# Altium schematic sheet RF_Driver.SchDoc: =MainTitle
size 420 x 297 mm; SheetNumber: 4; SheetTotal: 9; EDA_Number: ARTIQ; Projet: ARTIQ/SINARA; ModifiedBy: -; CreateDate: XX/XX/XXXX; CheckedDate: -; Title2: Driver Amplifier; DivGrp: ISE; Designer: shanasz
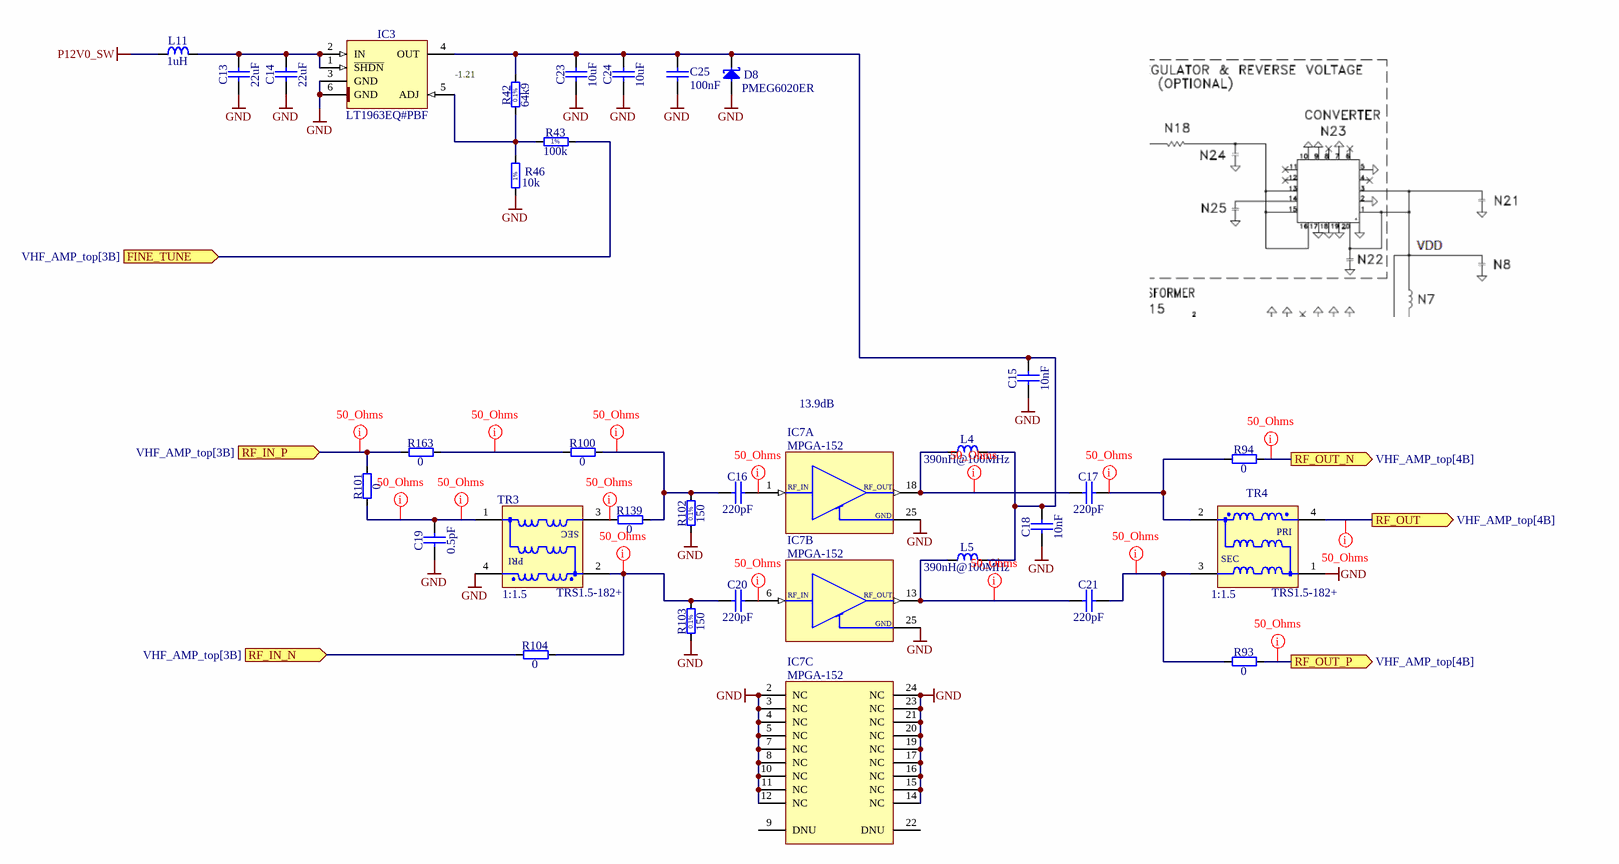
[diagram p0: RF_Driver.SchDoc]

## Parts
C13  22uF  [CAPC3225X140N]
C14  22uF  [CAPC3225X140N]
C15  10nF  [CAPC1005X55N]
C16  220pF  [CAPC1005X55N]
C17  220pF  [CAPC1005X55N]
C18  10nF  [CAPC1005X55N]
C19  0.5pF  [CAPC1005X50N]
C20  220pF  [CAPC1005X55N]
C21  220pF  [CAPC1005X55N]
C23  10uF  [CAPC3225X270N]
C24  10uF  [CAPC3225X270N]
C25  100nF  [CAPC1005X55N]
D8  PMEG6020ER  [SODFL3517X110N]
IC3  LT1963EQ#PBF  [TO170P1394X457-6N-R900X1060]
IC7  MPGA-152  [QFN50P400X400X100-25N-S265]  (parts A,B,C of 3)
L4  390nH@100MHz  [IND_COILCRAFT_0805HP]
L5  390nH@100MHz  [IND_COILCRAFT_0805HP]
L11  1uH  [INDC2620X100N]
R42  64k9  [RESC1608X55N]
R43  100k  [RESC1608X55N]
R46  10k  [RESC1005X40N]
R93  0  [RESC2012X60N]
R94  0  [RESC2012X60N]
R100  0  [RESC2012X60N]
R101  0  [RESC2012X60N]
R102  150  [RESC1608X55N]
R103  150  [RESC1608X55N]
R104  0  [RESC2012X60N]
R139  0  [RESC2012X60N]
R163  0  [RESC2012X60N]
TR3  1:1.5  Manufacturer Part Number: TRS1.5-182+  [XFMR_MINI-CIRCUITS_TT1618]
TR4  1:1.5  Manufacturer Part Number: TRS1.5-182+  [XFMR_MINI-CIRCUITS_TT1618]

## Ports
FINE_TUNE (in, see VHF_AMP_top[3B]), RF_IN_N (in, see VHF_AMP_top[3B]), RF_IN_P (in, see VHF_AMP_top[3B]), RF_OUT (out, see VHF_AMP_top[4B]), RF_OUT_N (out, see VHF_AMP_top[4B]), RF_OUT_P (out, see VHF_AMP_top[4B])

## Nets
GND: C13.1 C14.1 C15.1 C18.1 C19.1 C23.1 C24.1 C25.2 D8.2(A) IC3.3(GND) IC3.6(GND) IC7.2(NC) IC7.3(NC) IC7.4(NC) IC7.5(NC) IC7.7(NC) IC7.8(NC) IC7.10(NC) IC7.11(NC) IC7.12(NC) IC7.14(NC) IC7.15(NC) IC7.16(NC) IC7.17(NC) IC7.19(NC) IC7.20(NC) IC7.21(NC) IC7.23(NC) IC7.24(NC) IC7.25(GND) R46.1 R102.1 R103.1 TR3.4(P1) TR4.1(P1)
P12V0_SW: L11.1
FINE_TUNE: R43.2 ; port FINE_TUNE
RF_IN_N: R104.1 ; port RF_IN_N
RF_IN_P: R101.2 R163.1 ; port RF_IN_P
RF_OUT: TR4.4(P1) ; port RF_OUT
RF_OUT_N: R94.2 ; port RF_OUT_N
RF_OUT_P: R93.2 ; port RF_OUT_P
NetC13_2: C13.2 C14.2 IC3.1(~{SHDN}) IC3.2(IN) L11.2
NetC15_2: C15.2 C18.2 C23.2 C24.2 C25.1 D8.1(C) IC3.4(OUT) L4.2 L5.2 R42.2
NetC16_1: C16.1 R100.2 R102.2 R139.2
NetC16_2: C16.2 IC7.1(RF-IN,_A1)
NetC17_1: C17.1 IC7.18(RF-OUT_and_DC-IN,_A1) L4.1
NetC17_2: C17.2 R94.1 TR4.2(S1)
NetC19_2: C19.2 R101.1 TR3.1(P1)
NetC20_1: C20.1 R103.2 R104.2 TR3.2(S1)
NetC20_2: C20.2 IC7.6(RF_IN,_A2)
NetC21_1: C21.1 IC7.13(RF-OUT_and_DC-IN,_A2) L5.1
NetC21_2: C21.2 R93.1 TR4.3(S1)
NetIC3_5: IC3.5(ADJ) R42.1 R43.1 R46.2
NetR100_1: R100.1 R163.2
NetR139_1: R139.1 TR3.3(S1)

Not connected (* = marked no-connect by the designer): IC7 9(DNU) 22(DNU)

## Layout directives
net class 50_Ohms: NetC16_1, NetC16_2, NetC17_1, NetC17_2, NetC19_2, NetC20_1, NetC20_2, NetC21_1, NetC21_2, NetR100_1, NetR139_1, RF_IN_P, RF_OUT, RF_OUT_N, RF_OUT_P

## Notes on the sheet
- -1.21
- 13.9dB
- Project/Equipment
- Document
- Designer
- Drawn by
- Check.by
- Copyright WUT 2017
  This documentation describes Open Hardware and is licensed under the CERN OHL v.1.1. You may redistribute and modify this documentation under the terms of the CERN OHL v.1.1. (http://ohwr.org/CERNOHL). This documentation is distributed WITHOUT ANY EXPRESS OR IMPLIED WARRANTY, INCLUDING OF MERCHANTABILITY, SATISFACTORY QUALITY AND FITNESS FOR A PARTICULAR PURPOSE. Please see the CERN OHL v.1.1 for applicable conditions.
- File
- Last Mod.
- Print Date
- Sheet
- Size
- A3
- of
- Rev
- (in symbol MPGA-152, part A) RF_IN; RF_OUT
- (in symbol MPGA-152, part B) RF_IN; RF_OUT
- (in symbol R0402_10K_1%_0.0625W_100PPM) 1%
- (in symbol R0603_64K9_0.1%_0.063W_10PPM) 0.1%
- (in symbol R0603_100K_1%_0.1W_100PPM) 1%
- (in symbol R0603_150R_0.1%_0.063W_10PPM) 0.1%
- (in symbol XFMR_MINI-CIRCUITS_TRS1.5-182+) SEC; PRI

## Library data of the parts
C13 C14 = CC1210_22UF_25V_20%_X7R: Non-polarised capacitor; Part Description: SMD Multilayer Chip Ceramic Capacitor; Manufacturer: GENERIC; Manufacturer1 Part Number: C1210C226M3RACTU; Voltage: 25V; TC: X7R; Tolerance: ±20%; Part Number: CC1210_22UF_25V_20%_X7R; Component Kind: Standard; Component Type: Standard; Pin Count: 2; Value: 22uF; Status: None; Manufacturer Part Number: CC1210_22UF_25V_20%_X7R; Case: 1210; Mounted: Yes; Socket: No; SMD: Yes; Sense: No; Manufacturer1 Example: KEMET; Manufacturer1 ComponentHeight: 1.4mm; HelpURL: \\cern.ch\dfs\Applications\Altium\Datasheets\CC1210_X7R_KEMET.pdf; Author: CERN DEM JLC; CreateDate: 20.02.2018; LatestRevisionDate: 20.02.2018
C15 C18 = CC0402_10NF_16V_10%_X7R: Non-polarised capacitor; Part Description: SMD Multilayer Chip Ceramic Capacitor; Manufacturer: GENERIC; Manufacturer1 Part Number: 223878715636; Voltage: 16V; TC: X7R; Tolerance: ±10%; Part Number: CC0402_10NF_16V_10%_X7R; Component Kind: Standard; Component Type: Standard; Pin Count: 2; Value: 10nF; Status: Not Recommended; Manufacturer Part Number: CC0402_10NF_16V_10%_X7R; Case: 0402; Mounted: Yes; Socket: No; SMD: Yes; Sense: No; Manufacturer1 Example: PHYCOMP; Manufacturer1 ComponentHeight: 0.55mm; HelpURL: \\cern.ch\dfs\Applications\Altium\Datasheets\CC0402_X7R_PHYCOMP.pdf; Author: CERN DEM JLC; CreateDate: 03.12.2007; LatestRevisionDate: 03.12.2007
C16 C17 C20 C21 = CC0402_220PF_50V_5%_C0G: Non-polarised capacitor; Part Description: SMD Multilayer Chip Ceramic Capacitor; Manufacturer: GENERIC; Manufacturer1 Part Number: C0402C221J5GACTU; Voltage: 50V; TC: C0G/NP0; Tolerance: ±5%; Part Number: CC0402_220PF_50V_5%_C0G; Component Kind: Standard; Component Type: Standard; Pin Count: 2; Value: 220pF; Status: Preferred; Manufacturer Part Number: CC0402_220PF_50V_5%_C0G; Case: 0402; Mounted: Yes; Socket: No; SMD: Yes; Sense: No; Manufacturer1 Example: KEMET; Manufacturer1 ComponentHeight: 0.55mm; HelpURL: \\cern.ch\dfs\Applications\Altium\Datasheets\CC0402_C0G_KEMET_(Commercial Grade).pdf; Author: CERN DEM JLC; CreateDate: 03.12.2007; LatestRevisionDate: 22.04.2015
C19 = CC0402_0.5PF_25V_0.05PF_AVX_04023J0R5ABSTR: Non-polarised capacitor; Part Description: Thin-Film Chip Capacitor for RF Signal and Power Applications, Accu-P Series; Manufacturer: AVX; Voltage: 25V; Tolerance: ±0.05pF; Part Number: CC0402_0.5PF_25V_0.05PF_AVX_04023J0R5ABSTR; Component Kind: Standard; Component Type: Standard; Pin Count: 2; Value: 0.5pF; Status: None; Manufacturer Part Number: 04023J0R5ABSTR; Case: 0402; Mounted: Yes; Socket: No; SMD: Yes; Sense: No; ComponentHeight: 0.5mm; HelpURL: \\cern.ch\dfs\Applications\Altium\Datasheets\CC0402_AVX_ACCU-P.pdf; Author: CERN DEM JLC; CreateDate: 22.02.2017; LatestRevisionDate: 22.02.2017
C23 C24 = CC1210_10UF_25V_10%_X7R: Non-polarised capacitor; Part Description: SMD Multilayer Chip Ceramic Capacitor; Manufacturer: GENERIC; Manufacturer1 Part Number: C1210C106K4RACTU; Voltage: 25V; TC: X7R; Tolerance: ±10%; Part Number: CC1210_10UF_25V_10%_X7R; Component Kind: Standard; Component Type: Standard; Pin Count: 2; Value: 10uF; Status: None; Manufacturer Part Number: CC1210_10UF_25V_10%_X7R; Case: 1210; Mounted: Yes; Socket: No; SMD: Yes; Sense: No; Manufacturer1 Example: KEMET; Manufacturer1 ComponentHeight: 2.7mm; HelpURL: \\cern.ch\dfs\Applications\Altium\Datasheets\CC1210_X7R_KEMET.pdf; Author: CERN DEM JLC; CreateDate: 05.05.2009; LatestRevisionDate: 01.04.2010
C25 = CC0402_100NF_16V_10%_X5R: Non-polarised capacitor; Part Description: SMD Multilayer Chip Ceramic Capacitor; Manufacturer: GENERIC; Manufacturer1 Part Number: GRM155R61C104KA88D; Voltage: 16V; TC: X5R; Tolerance: ±10%; Part Number: CC0402_100NF_16V_10%_X5R; Component Kind: Standard; Component Type: Standard; Pin Count: 2; Value: 100nF; Status: None; Manufacturer Part Number: CC0402_100NF_16V_10%_X5R; Case: 0402; Mounted: Yes; Socket: No; SMD: Yes; Sense: No; Manufacturer1 Example: MURATA; Manufacturer1 ComponentHeight: 0.55mm; HelpURL: \\cern.ch\dfs\Applications\Altium\Datasheets\CC0402_X5R_MURATA_GRM.pdf; Author: CERN DEM JLC; CreateDate: 10.12.2013; LatestRevisionDate: 10.12.2013
D8 = PMEG6020ER: Schottky Diode; Part Description: MEGA Schottky Barrier Rectifier; Manufacturer: NXP SEMICONDUCTORS; Voltage: 60V; Power: 2A; PressFit: No; Bonding: No; Part Number: PMEG6020ER; Component Kind: Standard; Component Type: Standard; Device: PMEG6020ER; PackageDescription: SODFL Diode (SOD123W); 2.60mm W X 1.70mm L X 1.10mm H body, IPC Medium Density; Manufacturer Part Number: PMEG6020ER; Pin Count: 2; Case: SOD123; Mounted: Yes; Socket: No; SMD: Yes; Sense: No; ComponentHeight: 0.65mm; HelpURL: \\cern.ch\dfs\Applications\Altium\Datasheets\PMEG6020ER.pdf; Author: CERN DEM JMW; CreateDate: 19.06.2014; LatestRevisionDate: 19.06.2014
IC3 = LT1963EQ#PBF: 1.5A, Fast Transient Response Adjustable LDO Regulators; Part Description: 1.5A, 1.21V to 20V, Fast Transient Response, Adjustable LDO Regulator; Manufacturer: LINEAR TECHNOLOGY; PressFit: No; Bonding: No; Part Number: LT1963EQ#PBF; Component Kind: Standard; Component Type: Standard; Device: LT1963EQ#PBF; PackageDescription: D2PAK TO-263, TO, 1.70mm Pitch; 5 Pin, 13.945mm L X 8.89mm W X 4.572mm H body, IPC Medium Density; Manufacturer Part Number: LT1963EQ#PBF; Pin Count: 6; Case: TO-263; Mounted: Yes; Socket: No; SMD: Yes; Sense: No; ComponentHeight: 4.57mm; HelpURL: \\cern.ch\dfs\Applications\Altium\Datasheets\LT1963EQ#PBF.pdf; Author: CERN DEM JLC; CreateDate: 17.12.2013; LatestRevisionDate: 17.12.2013
IC7 = MPGA-152: Dual Differential Inputs and  Complementary TTL outputs; Part Description: 30GHz to 1500MHz, 50 Ohm, Low Noise, High IP3, Monolithic Amplifier; Manufacturer: MINI-CIRCUITS; PressFit: No; Bonding: No; Part Number: MPGA-152; Component Kind: Standard; Component Type: Standard; Device: MPGA-152; PackageDescription: QFN, 0.50mm Pitch, Square; 24 Pin, 4.00mm L X 4.00mm W X 1.00mm H body (w/Thermal Tab 2.65 X 2.65mm), IPC Medium Density; Manufacturer Part Number: MPGA-152; Pin Count: 25; Case: QFN24; Mounted: Yes; Socket: No; SMD: Yes; Sense: No; ComponentHeight: 1mm; Author: CERN DEM HF; HelpURL: \\cern.ch\dfs\Applications\Altium\Datasheets\MPGA-152.pdf; ComponentLink1URL: \\cern.ch\dfs\Applications\Altium\Datasheets\MINI-CIRCUITS_MPGA-152.pdf; ComponentLink1Description: Package Drawing; CreateDate: 30.05.2023; LatestRevisionDate: 30.05.2023
L4 L5 = IND0805_COILCRAFT_0805HP-391XGR: Inductor; Part Description: Chip Inductor; Power: 330mA; Resistance: 1.11R; Tolerance: ±2%; Part Number: IND0805_COILCRAFT_0805HP-391XGR; Component Kind: Standard; Component Type: Standard; Pin Count: 2; Value: 390nH@100MHz; Manufacturer: COILCRAFT; Manufacturer Part Number: 0805HP-391XGR; Case: 0805; Mounted: Yes; Socket: No; SMD: Yes; Sense: No; ComponentHeight: 1.55mm; HelpURL: \\cern.ch\dfs\Applications\Altium\Datasheets\IND_COILCRAFT_0805HP.pdf; Author: CERN DEM JLC; CreateDate: 21.03.2018; LatestRevisionDate: 21.03.2018
L11 = IND1008_1UH_20%_WURTH_74479787210B: Inductor; Part Description: Power Multilayer Inductor (WE-PMI Series); Manufacturer: WURTH ELEKTRONIK; Power: 1.95A; Resistance: 0.06R; Tolerance: ±20%; Part Number: IND1008_1UH_20%_WURTH_74479787210B; Component Kind: Standard; Component Type: Standard; Pin Count: 2; Value: 1uH; Status: None; Manufacturer Part Number: 74479787210B; Mounted: Yes; Socket: No; SMD: Yes; Sense: No; ComponentHeight: 1mm; HelpURL: \\cern.ch\dfs\Applications\Altium\Datasheets\IND_WURTH_WE-PMI_74479787210B.pdf; Author: CERN DEM JLC; CreateDate: 01.10.2014; LatestRevisionDate: 01.10.2014; Case: 1008
R42 = R0603_64K9_0.1%_0.063W_10PPM: Resistor - 0.1%; Part Description: Thin Film Chip Resistor; Manufacturer: GENERIC; Manufacturer1 Part Number: RN73C1J64K9BTDF; Power: 0.063W; TC: ±10ppm; PressFit: No; Part Number: R0603_64K9_0.1%_0.063W_10PPM; Component Kind: Standard; Component Type: Standard; Pin Count: 2; Value: 64k9; Status: Not Recommended; Tolerance: ±0.1%; Manufacturer Part Number: R0603_64K9_0.1%_0.063W_10PPM; Case: 0603; Mounted: Yes; Sense: No; Socket: No; SMD: Yes; Manufacturer1 Example: TYCO HOLSWORTHY; Manufacturer1 ComponentHeight: 0.5mm; HelpURL: \\cern.ch\dfs\Applications\Altium\Datasheets\R0603_Tyco_RN73.pdf; Author: CERN DEM JLC; CreateDate: 03.12.2007; LatestRevisionDate: 13.03.2008
R43 = R0603_100K_1%_0.1W_100PPM: Resistor - 1%; Part Description: General Purpose Thick Film Chip Resistor; Manufacturer: GENERIC; Manufacturer1 Part Number: NRC06F1003TRF; Power: 0.1W; TC: ±100ppm/°C; PressFit: No; Part Number: R0603_100K_1%_0.1W_100PPM; Component Kind: Standard; Component Type: Standard; Pin Count: 2; Value: 100k; Status: Preferred; Tolerance: ±1%; Manufacturer Part Number: R0603_100K_1%_0.1W_100PPM; Case: 0603; Mounted: Yes; Sense: No; Socket: No; SMD: Yes; Manufacturer1 Example: NIC COMPONENT; Manufacturer1 ComponentHeight: 0.55mm; HelpURL: \\cern.ch\dfs\Applications\Altium\Datasheets\R0603_NIC_NRC.pdf; Author: CERN DEM JLC; CreateDate: 03.12.2007; LatestRevisionDate: 13.03.2008
R46 = R0402_10K_1%_0.0625W_100PPM: Resistor - 1%; Part Description: General Purpose Thick Film Chip Resistor; Manufacturer: GENERIC; Manufacturer1 Part Number: 232270671003L; TC: ±100ppm/°C; PressFit: No; Part Number: R0402_10K_1%_0.0625W_100PPM; Component Kind: Standard; Component Type: Standard; Pin Count: 2; Value: 10k; Status: Not Recommended; Power: 0.0625W; Tolerance: ±1%; Manufacturer Part Number: R0402_10K_1%_0.0625W_100PPM; Case: 0402; Mounted: Yes; Sense: No; Socket: No; SMD: Yes; Manufacturer1 Example: YAGEO PHYCOMP; Manufacturer1 ComponentHeight: 0.4mm; HelpURL: \\cern.ch\dfs\Applications\Altium\Datasheets\R0402_Phycomp_RC0402.pdf; Author: CERN DEM JLC; CreateDate: 03.12.2007; LatestRevisionDate: 17.10.2012
R93 R94 R100 R101 R104 R139 R163 = R0805_0R_JUMPER: Resistor; Part Description: 2A (0.05R Max DC Resistance) Zero Ohm Jumper; Manufacturer: GENERIC; Manufacturer1 Part Number: NRC10Z0; PressFit: No; Part Number: R0805_0R_JUMPER; Component Kind: Standard; Component Type: Standard; Pin Count: 2; Value: 0; Status: Preferred; Manufacturer Part Number: R0805_0R_JUMPER; Case: 0805; Mounted: Yes; Sense: No; Socket: No; SMD: Yes; Manufacturer1 Example: NIC COMPONENT; Manufacturer1 ComponentHeight: 0.6mm; HelpURL: \\cern.ch\dfs\Applications\Altium\Datasheets\R0805_NIC_NRC.pdf; Author: CERN DEM JLC; CreateDate: 03.12.2007; LatestRevisionDate: 13.03.2008
R102 R103 = R0603_150R_0.1%_0.063W_10PPM: Resistor - 0.1%; Part Description: Thin Film Chip Resistor; Manufacturer: GENERIC; Manufacturer1 Part Number: RN73C1J150RBTDF; Power: 0.063W; TC: ±10ppm; PressFit: No; Part Number: R0603_150R_0.1%_0.063W_10PPM; Component Kind: Standard; Component Type: Standard; Pin Count: 2; Value: 150; Status: Not Recommended; Tolerance: ±0.1%; Manufacturer Part Number: R0603_150R_0.1%_0.063W_10PPM; Case: 0603; Mounted: Yes; Sense: No; Socket: No; SMD: Yes; Manufacturer1 Example: TYCO HOLSWORTHY; Manufacturer1 ComponentHeight: 0.5mm; HelpURL: \\cern.ch\dfs\Applications\Altium\Datasheets\R0603_Tyco_RN73.pdf; Author: CERN DEM JLC; CreateDate: 03.12.2007; LatestRevisionDate: 13.03.2008
TR3 TR4 = XFMR_MINI-CIRCUITS_TRS1.5-182+: 50 Ohms 10 to 1800MHz RF Transformer; Power: 1W; Part Number: XFMR_MINI-CIRCUITS_TRS1.5-182+; Component Kind: Standard; Component Type: Standard; Pin Count: 4; Value: 1:1.5; Status: None; Part Description: 50 Ohms 10 to 1800MHz RF Transformer; Manufacturer: MINI-CIRCUITS; Mounted: Yes; Socket: No; Sense: No; SMD: Yes; ComponentHeight: 3.05mm; HelpURL: \\cern.ch\dfs\Applications\Altium\Datasheets\XFMR_MINI-CIRCUITS_TRS1-5-182+.pdf; Author: CERN DEM BC; CreateDate: 09.06.2021; LatestRevisionDate: 09.06.2021